# EAGLE design MHI-AC-Ctrl_v2.2 (EAGLE 9.6.2)
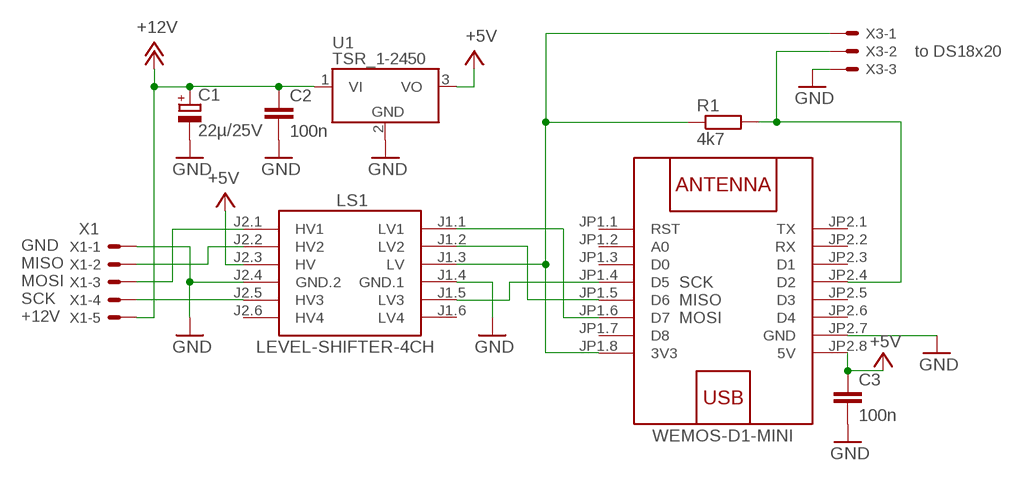
[diagram p0: schematic, sheet 1]

## Parts
C1  22µ/25V  CPOL-EUE15-5AXIAL  [E15-5]
C2  100n  C-EU025-024X044  [C025-024X044]
C3  100n  C-EU025-024X044  [C025-024X044]
LS1  LEVEL-SHIFTER-4CH  [LEVEL-SHIFTER-4CH]
R1  4k7  R-EU_0207/10  [0207/10]
U1  TSR_1-2450  TSR_1-24_  [TSR-1]
U$1  WEMOS-D1-MINI  [WEMOS-D1-MINI]
X1  JST 03JQ-BT  JST-JQ-05-LONG-PAD  [JST-XH-05-PACKAGE-LONG-PAD]
X3  JST-XH-03-PIN  [JST-XH-03-ST90-PACKAGE-LONG-PAD]

## Nets
+3V3: LS1.J1.3(LV) R1.1 U$1.JP1.8(3V3) X3.1
+5V: C3.1 LS1.J2.3(HV) U1.3(VO) U$1.JP2.8(5V)
+12V: C1.+ C2.1 U1.1(VI) X1.5
D2: R1.2 U$1.JP2.4(D2) X3.2
GND: C1.- C2.2 C3.2 LS1.J1.4(GND.1) LS1.J2.4(GND.2) U1.2(GND) U$1.JP2.7(GND) X1.1 X3.3
MISO: LS1.J2.2(HV2) X1.2
MISO_LV: LS1.J1.2(LV2) U$1.JP1.5(D6)
MOSI: LS1.J2.1(HV1) X1.3
MOSI_LV: LS1.J1.1(LV1) U$1.JP1.6(D7)
SCK: LS1.J2.5(HV3) X1.4
SCK_LV: LS1.J1.5(LV3) U$1.JP1.4(D5)
Unconnected: LS1.J1.6(LV4) LS1.J2.6(HV4) U$1.JP1.1(RST) U$1.JP1.2(A0) U$1.JP1.3(D0) U$1.JP1.7(D8) U$1.JP2.1(TX) U$1.JP2.2(RX) U$1.JP2.3(D1) U$1.JP2.5(D3) U$1.JP2.6(D4)

## Notes on the sheet
- to DS18x20
- X1
- SCK
- MISO
- MOSI

## Library data of the parts
C1 = rcl:CPOL-EU: POLARIZED CAPACITOR, European symbol; SPICEPREFIX: C
C2 C3 = rcl:C-EU: CAPACITOR, European symbol; SPICEPREFIX: C
LS1 = diy-modules:LEVEL-SHIFTER-4CH: 4-Channel Bi-Directional Logic Level Converter based on BSS128 transistors Click here to find device on ebay.com <http://www.ebay.com/sch/i2c+logic+converter+module>
R1 = rcl:R-EU_: RESISTOR, European symbol; SPICEPREFIX: R
U1 = _traco_tsr-1:TSR_1-*: TRACO TSR-1 Series Point-of-Load DC/DC-Converters Vi max. 36 V; Vo = (1.2 .. 15)V ±2%; Io = 0 .. 1 A SIP-Package (drop-in replacement for 78xx linear voltage regulators in TO220-package, vertically assembled) Source: www.tracopower.com Technologies: TSR 1- Vi (V) Vo (V) ±2% Io = 0 .. 1 A 24_ ( generic ) 2412 4.6 .. 36 1.2 2415 4.6 .. 36 1.5 2418 4.6 .. 36 1.8 2425 4.6 .. 36 2.5 2433 4.75.. 36 3.3 2450 6.5 .. 36 5.0 2465 9.0 .. 36 6.5 2490 12 .. 36 9.0 24120 15 .. 36 12 24150 18 .. 36 15 Author: Dipl.-Ing. FH Rainer Bayer HHN Hochschule Heilbronn, rainer.bayer@hs-heilbronn.de Ingenieurbüro ing-rb, mail@ing-rb.de
U$1 = diy-modules:WEMOS-D1-MINI: WEMOS D1 mini: Mini Wi-Fi Board based on ESP-8266 device More details can be found here: https://www.wemos.cc/product/d1-mini.html Click here to find device on ebay.com <http://www.ebay.com/sch/wemos+d1+mini+nodemcu>
X1 = Rembrandt Electronics - JST XH Connectors v1-0:JST-JQ-05: JST JQ Connector 5 Pin, 05JQ-BT Board to board connector. Pitch: 2,54 mm, (0.100") Number of pins: 5 https://jst.de/file/download/124/pitch-2-5-mm-btb-jq-pdf
X3 = Rembrandt Electronics - JST XH Connectors v1-0:JST-XH-03-PIN: JST XH Connector 3 Pin Wire to board connector. Pitch: 2,54 mm, (0.100") Number of pins: 3 Created by Rembrandt Electronics www.rembrandtelectronics.com

## Board
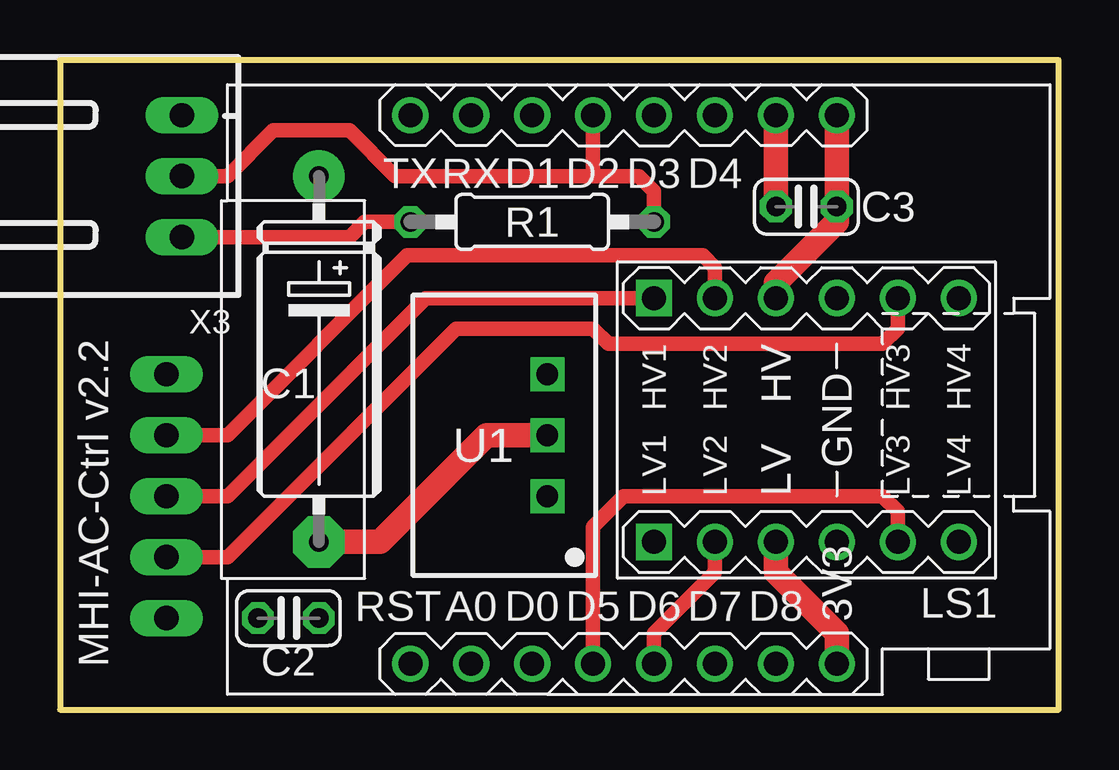
[diagram p1: board, top side]
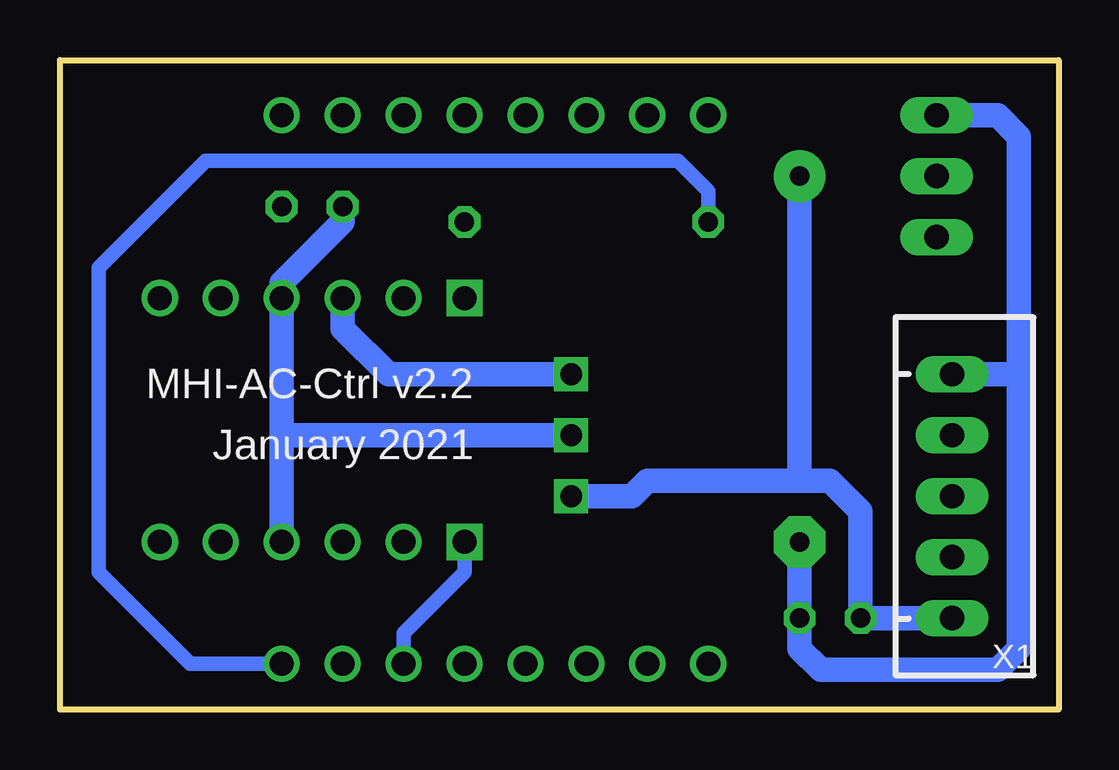
[diagram p2: board, bottom side, seen from below]

Size 41.63 x 27.07 mm. Coordinates in mm from the lower left corner, seen from the top.
Outline: 0,0 41.63,0 41.63,27.07 0,27.07 0,0
Copper layers (1*16): Top 0.035mm / dielectric 1.5mm / Bottom 0.035mm
Design rules "default": minimum track width 6mil, minimum drill 0.35mm, track to track 6mil, track to pad 6mil, pad to pad 6mil, via to via 6mil, smd to smd 6mil, copper to edge 40mil, drill to drill 6mil, minimum pad ring 10mil, minimum via ring 8mil, stop-mask expansion 4mil, vias tented up to drill 0mil, thermal gap 10mil

### Footprints (pad centres in the part's own frame; a part is rotated, then mirrored left to right if it is on the bottom)
E15-5 = drill 0.813 pad 2.159: + -7.62,0 | drill 0.813 pad 2.159 octagon: - 7.62,0
C025-024X044 = drill 0.813 octagon: 1 -1.27,0; 2 1.27,0
LEVEL-SHIFTER-4CH = drill 1 square: J1.1 -5.08,6.35; J2.1 5.08,6.35 | drill 1: J1.2 -5.08,3.81; J1.3 -5.08,1.27; J1.4 -5.08,-1.27; J1.5 -5.08,-3.81; J1.6 -5.08,-6.35; J2.2 5.08,3.81; J2.3 5.08,1.27; J2.4 5.08,-1.27; J2.5 5.08,-3.81; J2.6 5.08,-6.35
0207/10 = drill 0.813 octagon: 1 -5.08,0; 2 5.08,0
TSR-1 = drill 0.9 square: 1 -2.54,0; 2 0,0; 3 2.54,0
WEMOS-D1-MINI = drill 1: JP1.1 -11.43,9.525; JP1.2 -11.43,6.985; JP1.3 -11.43,4.445; JP1.4 -11.43,1.905; JP1.5 -11.43,-0.635; JP1.6 -11.43,-3.175; JP1.7 -11.43,-5.715; JP1.8 -11.43,-8.255; JP2.1 11.43,9.525; JP2.2 11.43,6.985; JP2.3 11.43,4.445; JP2.4 11.43,1.905; JP2.5 11.43,-0.635; JP2.6 11.43,-3.175; JP2.7 11.43,-5.715; JP2.8 11.43,-8.255
JST-XH-05-PACKAGE-LONG-PAD = drill 1.016 long: 1 -5.08,0; 2 -2.54,0; 3 0,0; 4 2.54,0; 5 5.08,0
JST-XH-03-ST90-PACKAGE-LONG-PAD = drill 1.016 long: 1 -2.54,0; 2 0,0; 3 2.54,0

### Placement (x,y rotation side)
C1  10.79,14.61 270 top
C2  9.53,3.81 0 top
C3  31.11,20.95 180 top
LS1  31.11,12.06 90 top
R1  19.68,20.32 0 top
U1  20.32,11.43 90 top
U$1  24.13,13.34 90 top
X1  4.45,8.89 270 bottom
X3  5.08,22.23 90 top

### Tracks (layer width: path | path; a pad name or v marks a point on that pad's centre or on a via)
+3V3
  Top 0.61: R1.1 12.7,20.32 12.06,19.68 X3.1
  Top 1.016: U$1.JP1.8 32.38,3.17 29.84,5.71 LS1.J1.3
  Bottom 0.61: U$1.JP1.8 36.2,1.91 40.01,5.71 40.01,18.41 35.56,22.86 15.88,22.86 14.61,21.59 R1.1
+5V
  Top 1.016: LS1.J2.3 29.84,17.78 32.38,20.32 C3.1 U$1.JP2.8
  Bottom 1.016: U1.3 27.94,13.97 29.84,15.88 LS1.J2.3
+12V
  Bottom 1.016: X1.5 C2.1 8.26,8.26 9.53,9.53 10.79,9.53 | U1.1 17.78,8.89 17.14,9.53 10.79,9.53 | 10.79,9.53 C1.+
D2
  Top 0.61: 22.23,22.23 13.97,22.23 12.06,24.13 8.89,24.13 6.99,22.23 X3.2 | U$1.JP2.4 22.23,22.23 | R1.2 24.77,21.59 24.13,22.23 22.23,22.23
GND
  Top 1.016: C1.- 13.34,6.99 17.78,11.43 U1.2 | U$1.JP2.7 C3.2
  Bottom 1.016: C3.2 29.84,20.32 32.38,17.78 LS1.J2.4 32.38,11.43 | 32.38,11.43 LS1.J1.4 | C1.- C2.2 10.79,2.54 9.91,1.65 2.54,1.65 1.65,2.54 1.65,13.72 1.91,13.97 | 1.91,13.97 1.65,13.97 1.65,23.88 2.54,24.77 X3.3 | 1.91,13.97 X1.1 | U1.2 32.38,11.43
MISO
  Top 0.61: LS1.J2.2 27.3,18.41 26.8,18.92 14.48,18.92 6.99,11.43 X1.2
MISO_LV
  Top 0.61: LS1.J1.2 27.3,5.71 24.77,3.17 U$1.JP1.5
MOSI
  Top 0.61: LS1.J2.1 15.24,17.14 6.99,8.89 X1.3
MOSI_LV
  Bottom 0.61: LS1.J1.1 24.77,5.71 27.3,3.17 U$1.JP1.6
SCK
  Top 0.61: X1.4 6.99,6.35 16.51,15.88 22.23,15.88 22.86,15.24 34.29,15.24 34.92,15.88 LS1.J2.5
SCK_LV
  Top 0.61: LS1.J1.5 34.92,8.26 34.29,8.89 23.5,8.89 22.23,7.62 U$1.JP1.4

### Text on the board
tPlace: MHI-AC-Ctrl v2.2
bPlace: MHI-AC-Ctrl v2.2 | January 2021